# Altium schematic sheet _i2c0.SchDoc
size Tabloid
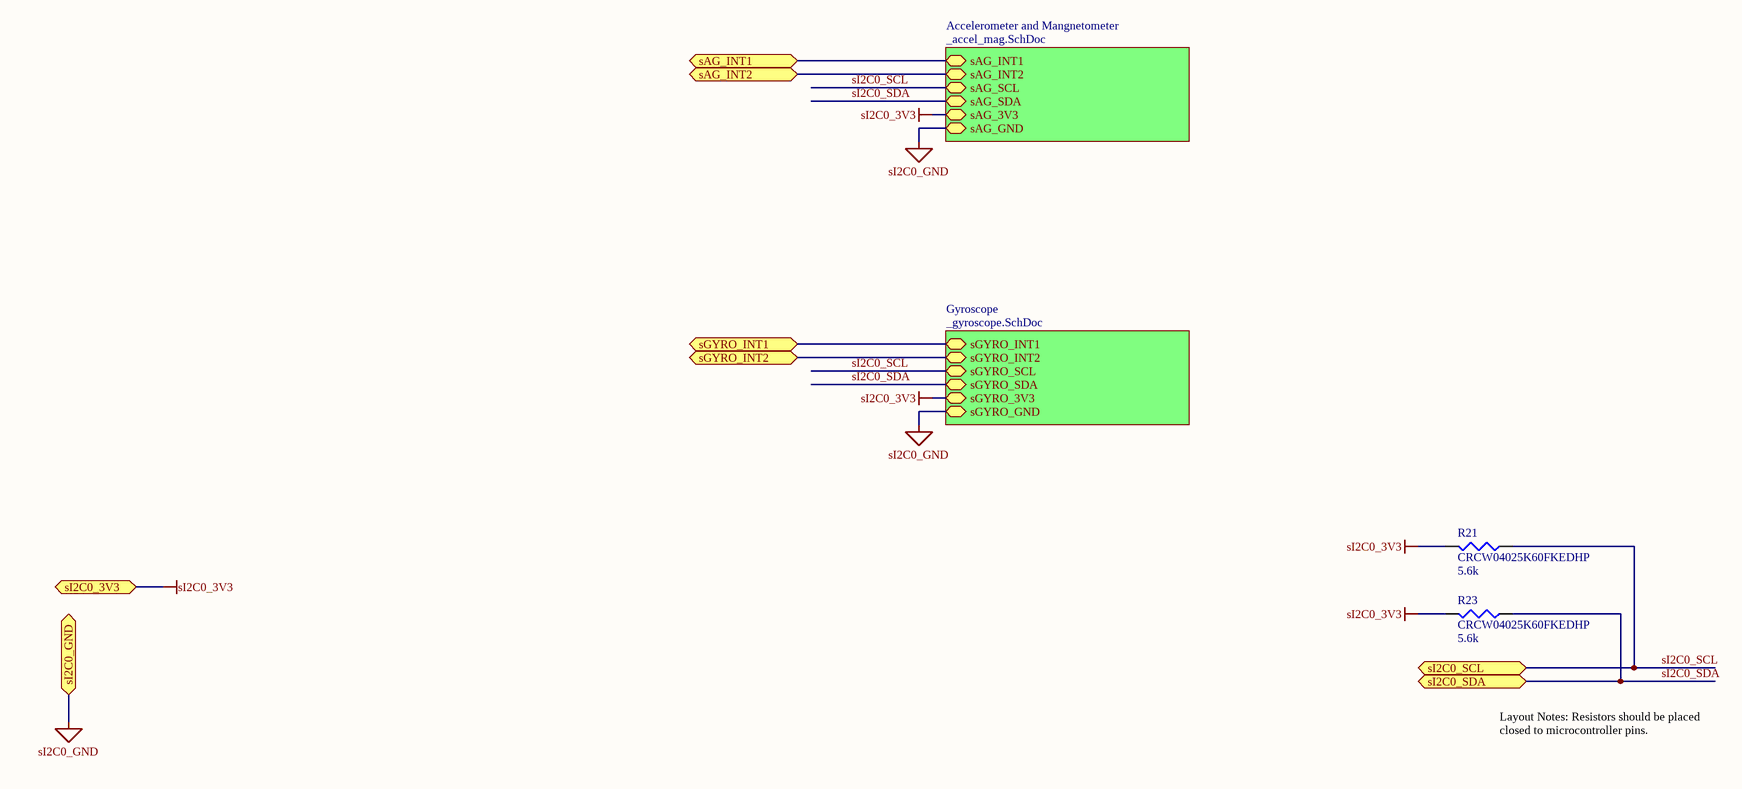
[diagram p0: _i2c0.SchDoc]

## Parts
R21  CRCW04025K60FKEDHP  value 5.6k  [0402]
R23  CRCW04025K60FKEDHP  value 5.6k  [0402]

## Sub-sheets
Accelerometer and Mangnetometer = _accel_mag.SchDoc: sAG_3V3, sAG_GND, sAG_SCL, sAG_SDA, sAG_INT1, sAG_INT2
Gyroscope = _gyroscope.SchDoc: sGYRO_3V3, sGYRO_GND, sGYRO_INT1, sGYRO_INT2, sGYRO_SCL, sGYRO_SDA

## Ports
sAG_INT1, sAG_INT2, sGYRO_INT1, sGYRO_INT2, sI2C0_3V3, sI2C0_GND, sI2C0_SCL, sI2C0_SDA

## Nets
sI2C0_3V3: R21.2 R23.2 ; port sI2C0_3V3, sheet Accelerometer and Mangnetometer/sAG_3V3, sheet Gyroscope/sGYRO_3V3
sI2C0_GND: port sI2C0_GND, sheet Accelerometer and Mangnetometer/sAG_GND, sheet Gyroscope/sGYRO_GND
sAG_INT1: port sAG_INT1, sheet Accelerometer and Mangnetometer/sAG_INT1
sAG_INT2: port sAG_INT2, sheet Accelerometer and Mangnetometer/sAG_INT2
sGYRO_INT1: port sGYRO_INT1, sheet Gyroscope/sGYRO_INT1
sGYRO_INT2: port sGYRO_INT2, sheet Gyroscope/sGYRO_INT2
sI2C0_SCL: R21.1 ; port sI2C0_SCL, sheet Accelerometer and Mangnetometer/sAG_SCL, sheet Gyroscope/sGYRO_SCL
sI2C0_SDA: R23.1 ; port sI2C0_SDA, sheet Accelerometer and Mangnetometer/sAG_SDA, sheet Gyroscope/sGYRO_SDA

## Notes on the sheet
- Layout Notes: Resistors should be placed closed to microcontroller pins.

## Library data of the parts
R21 R23 = CRCW0402xxxxFKED: 0.125W, -55-155C, 1005, 50V, ±1%